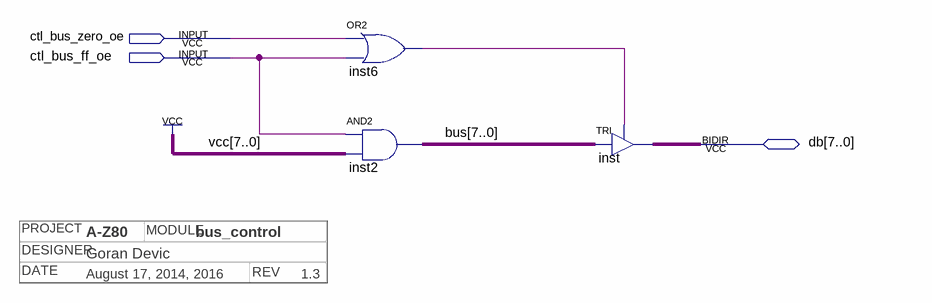
[diagram p0: schematic sheet]
// Quartus schematic bus_control.bdf as structural Verilog: 3 symbols, 3 pins
// Title block: DATE: August 17, 2014, 2016; DESIGNER: Goran Devic; MODULE: bus_control; PROJECT: A-Z80; REV: 1.3
module bus_control (
  input  ctl_bus_zero_oe,
  input  ctl_bus_ff_oe,
  inout  [7:0] db
);

  wire inst6_out;
  wire [7:0] bus;

  or inst6 (inst6_out, ctl_bus_zero_oe, ctl_bus_ff_oe);
  assign bus = {8{ctl_bus_ff_oe}} & {8{1'b1}};  // AND2 inst2, 8 bits wide
  TRI inst[7:0] (.IN(bus), .OE(inst6_out), .OUT(db));
endmodule
